# Altium project payload_flight_controller.PrjPcb (part 1 of 4)
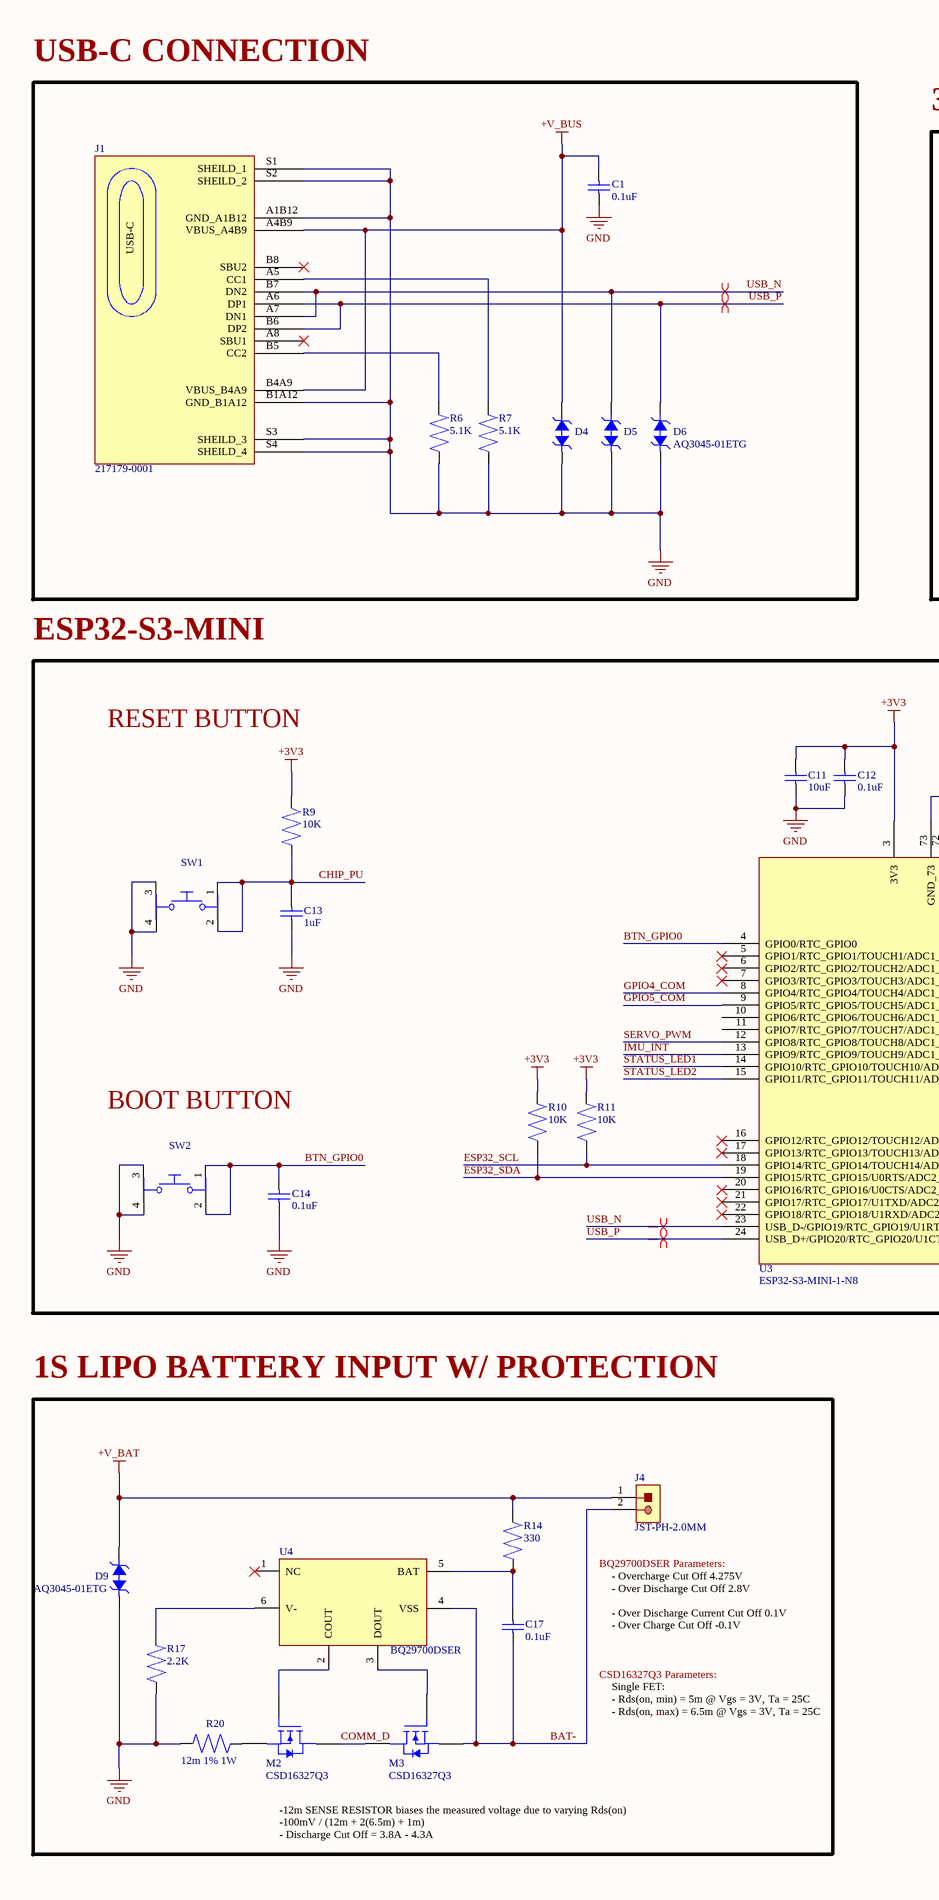
[diagram p0: payload_esp32.SchDoc, left]
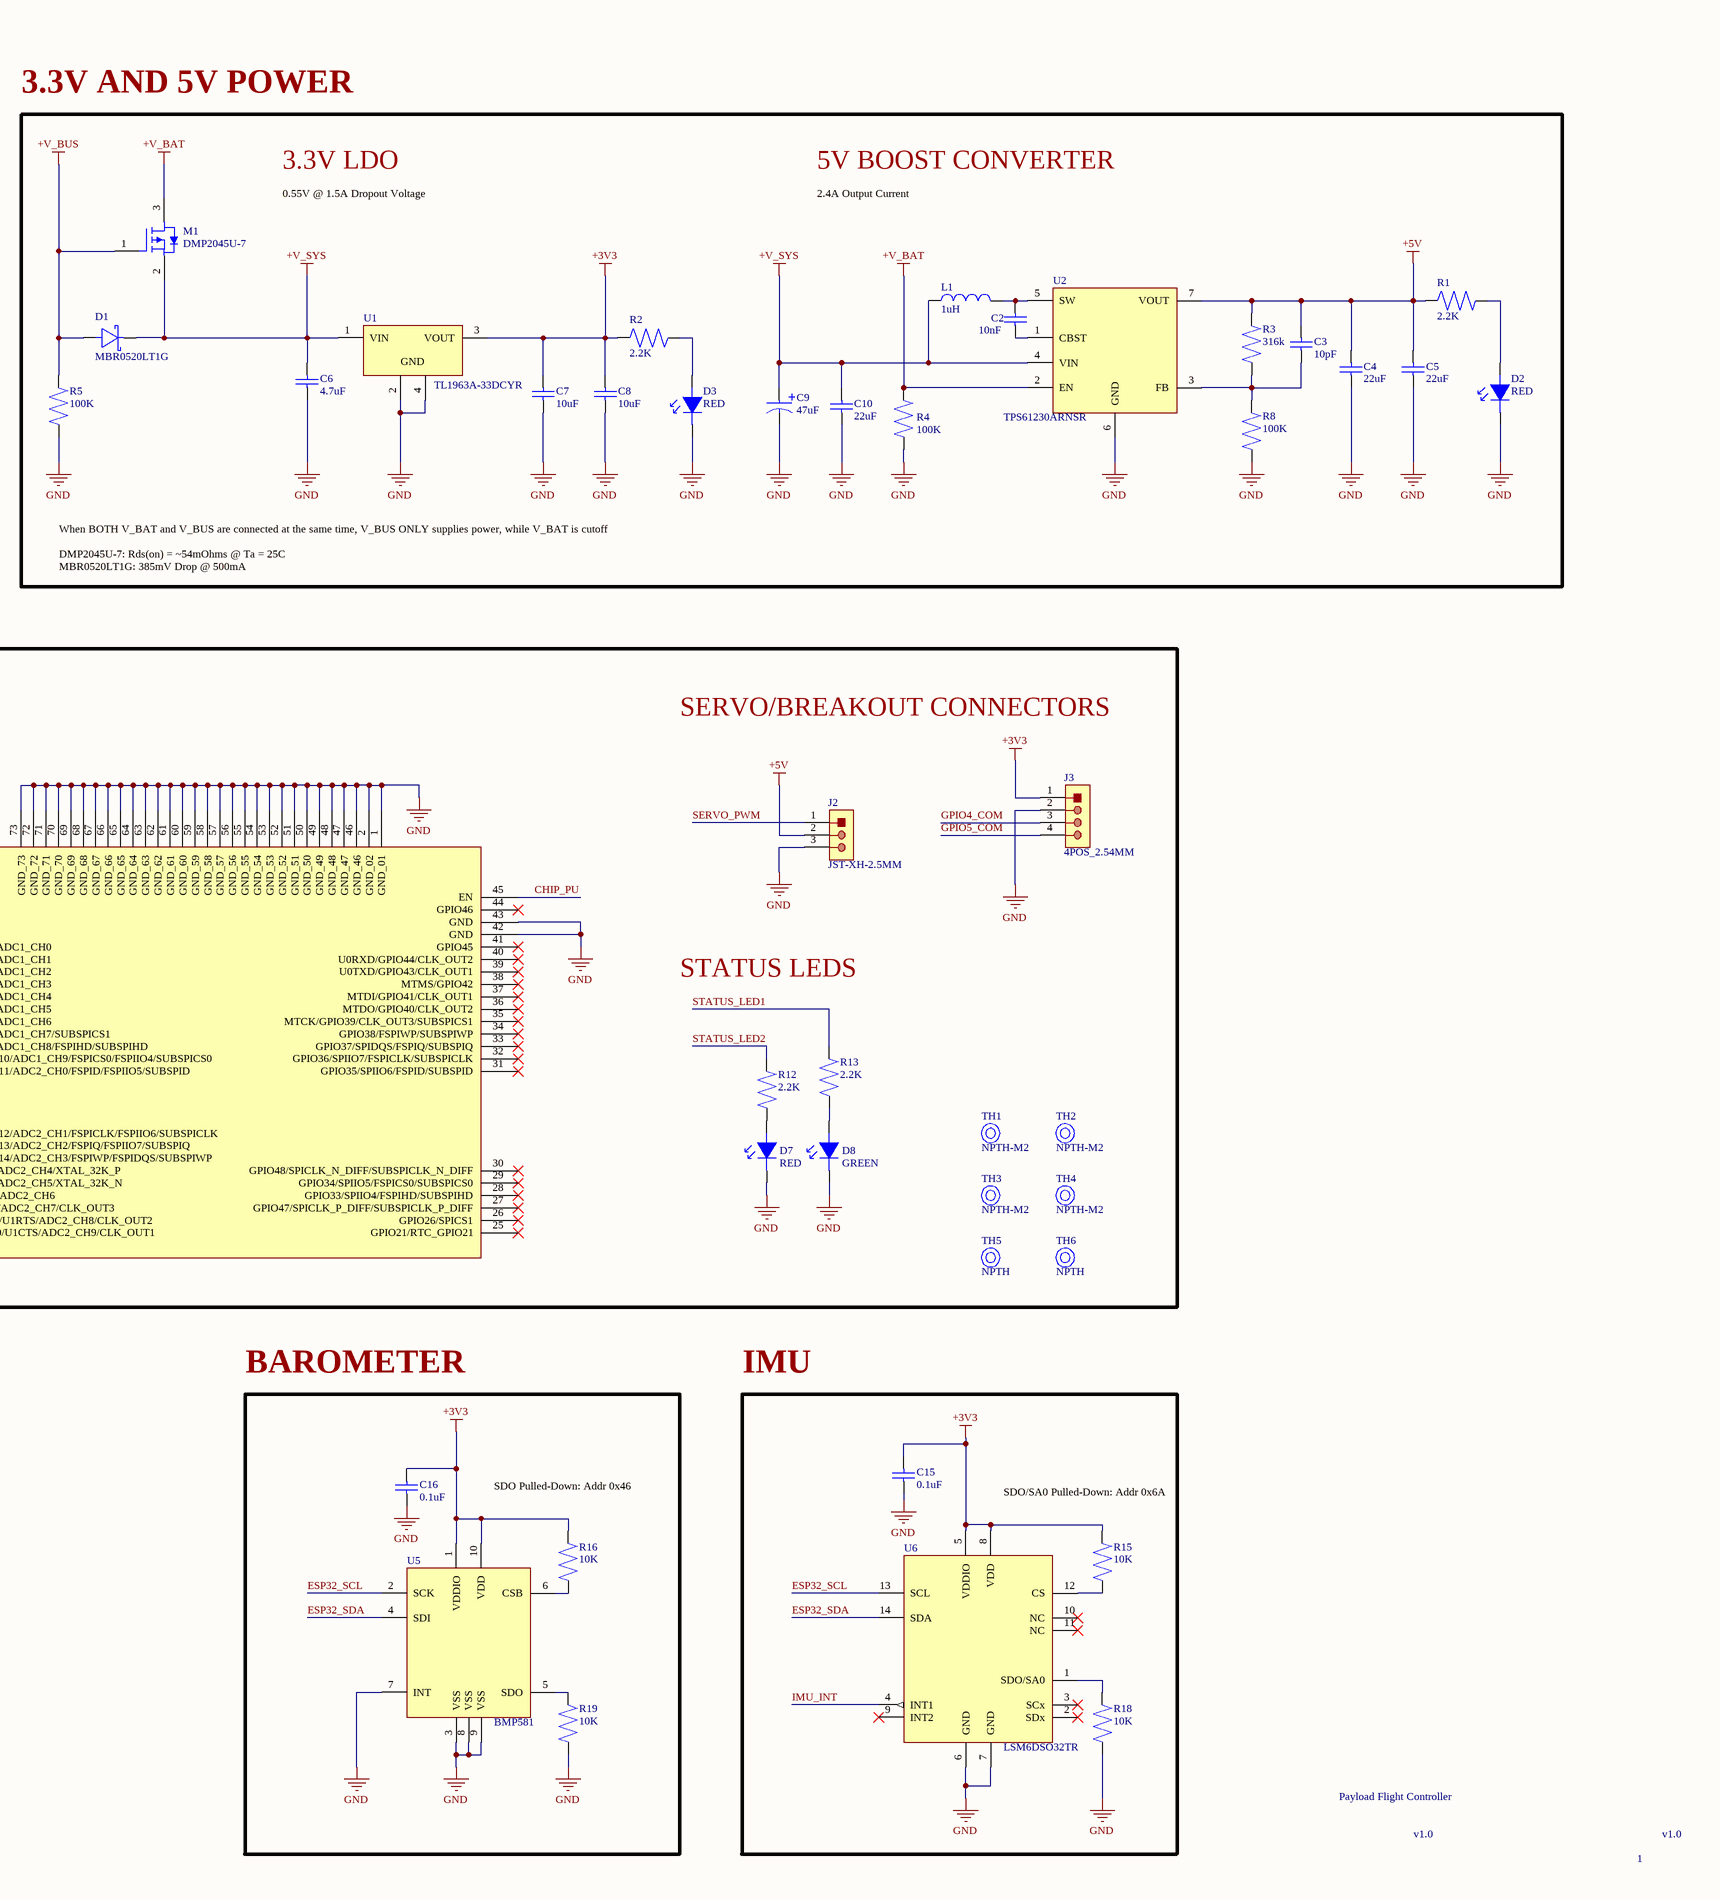
[diagram p1: payload_esp32.SchDoc, right]
1 sheet, 68 parts. Net scope: global (net labels, ports and power ports of the same name join across sheets).
Board file: payload_esp32_pcb.PcbDoc

## Sheet payload_esp32.SchDoc
size A2; SheetNumber: 1; SheetTotal: 1

### Parts
C1  0.1uF  [CAPC1005X70N]
C2  10nF  [CAPC1005X70N]
C3  10pF  [FP-CC0603-DA-IPC_B]
C4  22uF  [FP-GRM21B-0_2-e0_2_0_7-IPC_A]
C5  22uF  [FP-GRM21B-0_2-e0_2_0_7-IPC_A]
C6  4.7uF  [CAPC1005X70N]
C7  10uF  [CAPC1005X70N]
C8  10uF  [CAPC1005X70N]
C9  47uF  [CAPAE5553X61M]
C10  22uF  [FP-GRM21B-0_2-e0_2_0_7-IPC_A]
C11  10uF  [CAPC1005X70N]
C12  0.1uF  [CAPC1005X70N]
C13  1uF  [CAPC1005X70N]
C14  0.1uF  [CAPC1005X70N]
C15  0.1uF  [CAPC1005X70N]
C16  0.1uF  [CAPC1005X70N]
C17  0.1uF  [FP-CC0603-DA-IPC_B]
D1  MBR0520LT1G  [FP-425-04-IPC_B]
D2  RED  [LED0402G]
D3  RED  [LED0402G]
D4  AQ3045-01ETG  [SOD882]  (value not drawn)
D5  AQ3045-01ETG  [SOD882]  (value not drawn)
D6  AQ3045-01ETG  [SOD882]
D7  RED  [LED0402G]
D8  GREEN  [LED0402G]
D9  AQ3045-01ETG  [SOD882]
J1  217179-0001  [FP-2171790001-MFG]
J2  JST-XH-2.5MM  [JST-S3B-XH-A(LF)(SN)_V]
J3  4POS_2.54MM  [HDR_1x4_2.54MM]
J4  JST-PH-2.0MM  [JST-S2B-PH-K-S_V]
L1  1uH  [COIL-XFL4020_V]
M1  DMP2045U-7  [SOT23-3]
M2  CSD16327Q3  [8-PowerTDFN]
M3  CSD16327Q3  [8-PowerTDFN]
R1  2.2K  [RESC1005X37N]
R2  2.2K  [RESC1005X37N]
R3  316k  [RES_0603]
R4  100K  [RES_0603]
R5  100K  [RES_0603]
R6  5.1K  [RESC1005X37N]
R7  5.1K  [RESC1005X37N]
R8  100K  [RES_0603]
R9  10K  [RESC1005X37N]
R10  10K  [RESC1005X37N]
R11  10K  [RESC1005X37N]
R12  2.2K  [RESC1005X37N]
R13  2.2K  [RESC1005X37N]
R14  330  [RESC1005X37N]
R15  10K  [RESC1005X37N]
R16  10K  [RESC1005X37N]
R17  2.2K  [RESC1005X37N]
R18  10K  [RESC1005X37N]
R19  10K  [RESC1005X37N]
R20  12m 1% 1W  [RES_1206]
SW1  PTS645SH50SMTR92LFS  [FP-PTS645SH50SMTR92LFS-MFG]  (value not drawn)
SW2  PTS645SH50SMTR92LFS  [FP-PTS645SH50SMTR92LFS-MFG]  (value not drawn)
TH1  NPTH-M2  [NPMTH-M2]
TH2  NPTH-M2  [NPMTH-M2]
TH3  NPTH-M2  [NPMTH-M2]
TH4  NPTH-M2  [NPMTH-M2]
TH5  NPTH  [NPMTH_TOOLING]
TH6  NPTH  [NPMTH_TOOLING]
U1  TL1963A-33DCYR  [DCY0004A_N]
U2  TPS61230ARNSR  [FP-RNS0007A-MFG]
U3  ESP32-S3-MINI-1-N8  [XCVR_ESP32-S3-MINI-1-N8]
U4  BQ29700DSER  [WSON]
U5  BMP581  [10-WFLGA]
U6  LSM6DSO32TR  [FP-LGA-14L-DM00249496-MFG]

### Blocks framed on the sheet
USB-C CONNECTION: C1 D4-D6 J1 R6 R7
3.3V AND 5V POWER: C2-C10 D1-D3 L1 M1 R1-R5 R8 U1 U2
ESP32-S3-MINI: C11-C14 D7 D8 J2 J3 R9-R13 SW1 SW2 TH1-TH6 U3
1S LIPO BATTERY INPUT W/ PROTECTION: C17 D9 J4 M2 M3 R14 R17 R20 U4
BAROMETER: C16 R16 R19 U5
IMU: C15 R15 R18 U6

### Nets
+3V3: C7.2 C8.2 C11.2 C12.2 C15.2 C16.2 J3.1 R2.2 R9.2 R10.2 R11.2 R15.2 R16.2 U1.3(VOUT) U3.3(3V3) U5.1(VDDIO) U5.10(VDD) U6.5(VDDIO) U6.8(VDD)
+5V: C3.2 C4.2 C5.2 J2.2 R1.2 R3.2 U2.7(VOUT)
+V_BAT: D9.2 J4.1 M1.3(D) R4.2 R14.2 U2.2(EN)
+V_BUS: C1.2 D1.2 D4.2 J1.A4B9(VBUS_A4B9) J1.B4A9(VBUS_B4A9) M1.1(G) R5.2
+V_SYS: C6.2 C9.1 C10.2 D1.1 L1.1 M1.2(S) U1.1(VIN) U2.4(VIN)
GND: C1.1 C4.1 C5.1 C6.1 C7.1 C8.1 C9.2 C10.1 C11.1 C12.1 C13.1 C14.1 C15.1 C16.1 D2.1 D3.1 D4.1 D5.1 D6.1 D7.1 D8.1 D9.1 J1.A1B12(GND_A1B12) J1.B1A12(GND_B1A12) J1.S1(SHEILD_1) J1.S2(SHEILD_2) J1.S3(SHEILD_3) J1.S4(SHEILD_4) J2.3 J3.2 R4.1 R5.1 R6.1 R7.1 R8.1 R17.1 R18.1 R19.1 R20.1 SW1.3 SW1.4 SW2.3 SW2.4 U1.2(GND) U1.4(GND) U2.6(GND) U3.1(GND_01) U3.2(GND_02) U3.42(GND) U3.43(GND) U3.46(GND_46) U3.47(GND_47) U3.48(GND_48) U3.49(GND_49) U3.50(GND_50) U3.51(GND_51) U3.52(GND_52) U3.53(GND_53) U3.54(GND_54) U3.55(GND_55) U3.56(GND_56) U3.57(GND_57) U3.58(GND_58) U3.59(GND_59) U3.60(GND_60) U3.61(GND_61) U3.62(GND_62) U3.63(GND_63) U3.64(GND_64) U3.65(GND_65) U3.66(GND_66) U3.67(GND_67) U3.68(GND_68) U3.69(GND_69) U3.70(GND_70) U3.71(GND_71) U3.72(GND_72) U3.73(GND_73) U5.3(VSS) U5.7(INT) U5.8(VSS) U5.9(VSS) U6.6(GND) U6.7(GND)
BAT-: C17.1 J4.2 M3.1,_2,_3(S) U4.4(VSS)
BTN_GPIO0: C14.2 SW2.1 SW2.2 U3.4(GPIO0/RTC_GPIO0)
CHIP_PU: C13.2 R9.1 SW1.1 SW1.2 U3.45(EN)
COMM_D: M2.5,_6,_7,_8(D) M3.5,_6,_7,_8(D)
ESP32_SCL: R11.1 U3.18(GPIO14/RTC_GPIO14/TOUCH14/ADC2_CH3/FSPIWP/FSPIDQS/SUBSPIWP) U5.2(SCK) U6.13(SCL)
ESP32_SDA: R10.1 U3.19(GPIO15/RTC_GPIO15/U0RTS/ADC2_CH4/XTAL_32K_P) U5.4(SDI) U6.14(SDA)
GPIO4_COM: J3.3 U3.8(GPIO4/RTC_GPIO4/TOUCH4/ADC1_CH3)
GPIO5_COM: J3.4 U3.9(GPIO5/RTC_GPIO5/TOUCH5/ADC1_CH4)
IMU_INT: U3.13(GPIO9/RTC_GPIO9/TOUCH9/ADC1_CH8/FSPIHD/SUBSPIHD) U6.4(INT1)
SERVO_PWM: J2.1 U3.12(GPIO8/RTC_GPIO8/TOUCH8/ADC1_CH7/SUBSPICS1)
STATUS_LED1: R13.2 U3.14(GPIO10/RTC_GPIO10/TOUCH10/ADC1_CH9/FSPICS0/FSPIIO4/SUBSPICS0)
STATUS_LED2: R12.2 U3.15(GPIO11/RTC_GPIO11/TOUCH11/ADC2_CH0/FSPID/FSPIIO5/SUBSPID)
USB_N: D5.2 J1.A7(DN1) J1.B7(DN2) U3.23(USB_D-/GPIO19/RTC_GPIO19/U1RTS/ADC2_CH8/CLK_OUT2)
USB_P: D6.2 J1.A6(DP1) J1.B6(DP2) U3.24(USB_D+/GPIO20/RTC_GPIO20/U1CTS/ADC2_CH9/CLK_OUT1)
NetC2_1: C2.1 U2.1(CBST)
NetC2_2: C2.2 L1.2 U2.5(SW)
NetC3_1: C3.1 R3.1 R8.2 U2.3(FB)
NetC17_2: C17.2 R14.1 U4.5(BAT)
NetD2_2: D2.2 R1.1
NetD3_2: D3.2 R2.1
NetD7_2: D7.2 R12.1
NetD8_2: D8.2 R13.1
NetJ1_A5: J1.A5(CC1) R7.2
NetJ1_B5: J1.B5(CC2) R6.2
NetM2_1, 2, 3: M2.1,_2,_3(S) R20.2
NetM2_4: M2.4(G) U4.2(COUT)
NetM3_4: M3.4(G) U4.3(DOUT)
NetR15_1: R15.1 U6.12(CS)
NetR16_1: R16.1 U5.6(CSB)
NetR17_2: R17.2 U4.6(V-)
NetR18_2: R18.2 U6.1(SDO/SA0)
NetR19_2: R19.2 U5.5(SDO)

Not connected (* = marked no-connect by the designer): J1 A8(SBU1)* B8(SBU2)*; U3 5(GPIO1/RTC_GPIO1/TOUCH1/ADC1_CH0)* 6(GPIO2/RTC_GPIO2/TOUCH2/ADC1_CH1)* 7(GPIO3/RTC_GPIO3/TOUCH3/ADC1_CH2)* 10(GPIO6/RTC_GPIO6/TOUCH6/ADC1_CH5) 11(GPIO7/RTC_GPIO7/TOUCH7/ADC1_CH6) 16(GPIO12/RTC_GPIO12/TOUCH12/ADC2_CH1/FSPICLK/FSPIIO6/SUBSPICLK)* 17(GPIO13/RTC_GPIO13/TOUCH13/ADC2_CH2/FSPIQ/FSPIIO7/SUBSPIQ)* 20(GPIO16/RTC_GPIO16/U0CTS/ADC2_CH5/XTAL_32K_N)* 21(GPIO17/RTC_GPIO17/U1TXD/ADC2_CH6)* 22(GPIO18/RTC_GPIO18/U1RXD/ADC2_CH7/CLK_OUT3)* 25(GPIO21/RTC_GPIO21)* 26(GPIO26/SPICS1)* 27(GPIO47/SPICLK_P_DIFF/SUBSPICLK_P_DIFF)* 28(GPIO33/SPIIO4/FSPIHD/SUBSPIHD)* 29(GPIO34/SPIIO5/FSPICS0/SUBSPICS0)* 30(GPIO48/SPICLK_N_DIFF/SUBSPICLK_N_DIFF)* 31(GPIO35/SPIIO6/FSPID/SUBSPID)* 32(GPIO36/SPIIO7/FSPICLK/SUBSPICLK)* 33(GPIO37/SPIDQS/FSPIQ/SUBSPIQ)* 34(GPIO38/FSPIWP/SUBSPIWP)* 35(MTCK/GPIO39/CLK_OUT3/SUBSPICS1)* 36(MTDO/GPIO40/CLK_OUT2)* 37(MTDI/GPIO41/CLK_OUT1)* 38(MTMS/GPIO42)* 39(U0TXD/GPIO43/CLK_OUT1)* 40(U0RXD/GPIO44/CLK_OUT2)* 41(GPIO45)* 44(GPIO46)*; U4 1(NC)*; U6 2(SDx)* 3(SCx)* 9(INT2)* 10(NC)* 11(NC)*

### Layout directives
differential pair: USB_N, USB_P

### Notes on the sheet
- 3.3V LDO
- 0.55V @ 1.5A Dropout Voltage
- 5V BOOST CONVERTER
- 2.4A Output Current
- When BOTH V_BAT and V_BUS are connected at the same time, V_BUS ONLY supplies power, while V_BAT is cutoff
- MBR0520LT1G: 385mV Drop @ 500mA
- DMP2045U-7: Rds(on) = ~54mOhms @ Ta = 25C
- RESET BUTTON
- SERVO/BREAKOUT CONNECTORS
- STATUS LEDS
- BOOT BUTTON
- SDO Pulled-Down: Addr 0x46
- SDO/SA0 Pulled-Down: Addr 0x6A
- BQ29700DSER Parameters:
- - Overcharge Cut Off 4.275V
- - Over Discharge Cut Off 2.8V
- - Over Discharge Current Cut Off 0.1V
- - Over Charge Cut Off -0.1V
- CSD16327Q3 Parameters:
- Single FET:
- - Rds(on, min) = 5m @ Vgs = 3V, Ta = 25C
- - Rds(on, max) = 6.5m @ Vgs = 3V, Ta = 25C
- -12m SENSE RESISTOR biases the measured voltage due to varying Rds(on)
- Payload Flight Controller
- - Discharge Cut Off = 3.8A - 4.3A
- -100mV / (12m + 2(6.5m) + 1m)
- v1.0
- 1
- (in symbol 217179-0001) USB-C